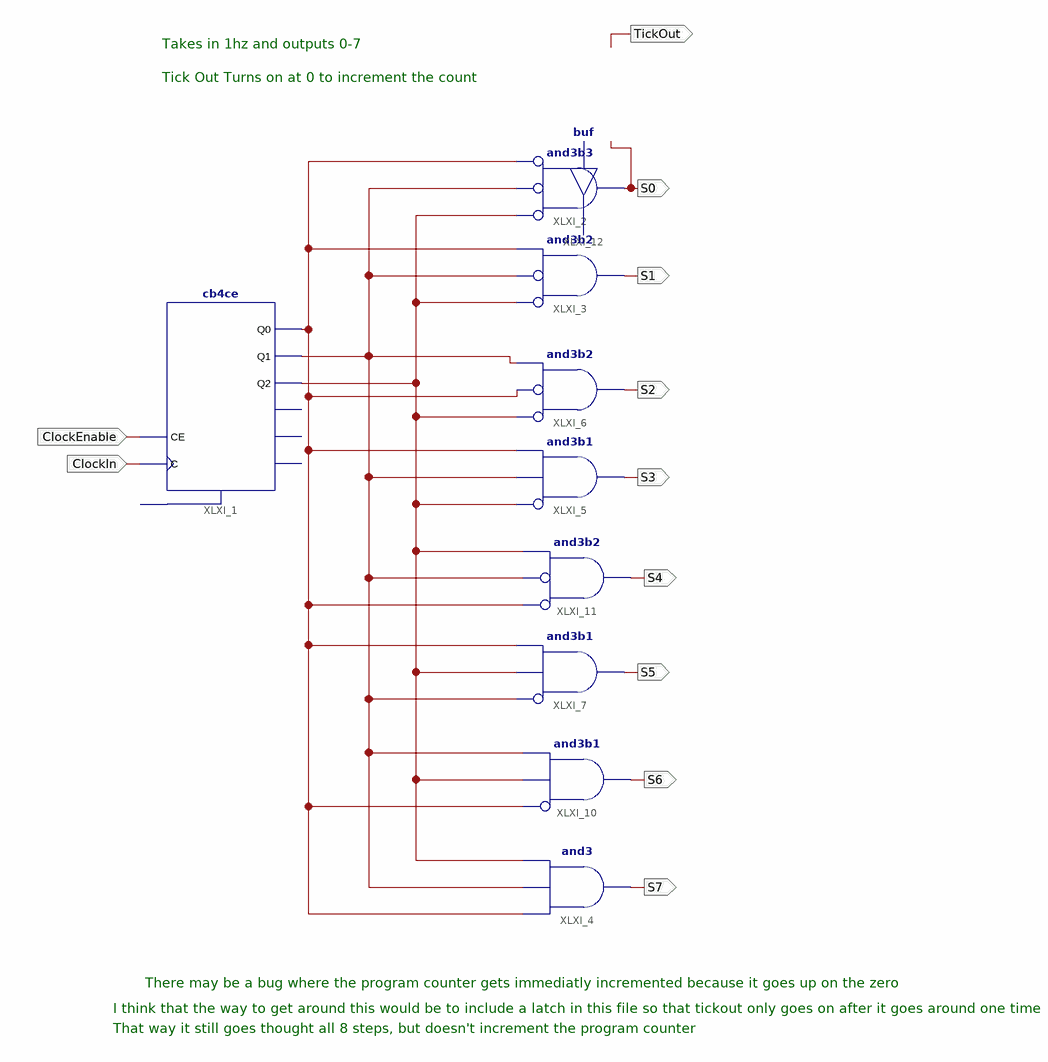
[diagram p0: schematic sheet 1]
// Xilinx ISE schematic TickerTocker.sch (spartan3e) as structural Verilog: 10 symbols, 11 ports
module TickerTocker (
  input  ClockEnable,
  input  ClockIn,
  output S0,
  output S1,
  output S2,
  output S3,
  output S4,
  output S5,
  output S6,
  output S7,
  output TickOut
);

  wire XLXN_4, XLXN_6, XLXN_8;

  cb4ce XLXI_1 (.C(ClockIn), .CE(ClockEnable), .Q0(XLXN_4), .Q1(XLXN_8), .Q2(XLXN_6));  // open: CLR, CEO, Q3, TC
  and XLXI_2 (S0, ~XLXN_6, ~XLXN_8, ~XLXN_4);  // and3b3
  and XLXI_3 (S1, ~XLXN_6, ~XLXN_8, XLXN_4);  // and3b2
  and XLXI_11 (S4, ~XLXN_4, ~XLXN_8, XLXN_6);  // and3b2
  and XLXI_5 (S3, ~XLXN_6, XLXN_8, XLXN_4);  // and3b1
  and XLXI_6 (S2, ~XLXN_6, ~XLXN_4, XLXN_8);  // and3b2
  and XLXI_7 (S5, ~XLXN_8, XLXN_6, XLXN_4);  // and3b1
  and XLXI_10 (S6, ~XLXN_4, XLXN_6, XLXN_8);  // and3b1
  and XLXI_4 (S7, XLXN_4, XLXN_8, XLXN_6);
  buf XLXI_12 (TickOut, S0);

  // Notes on the sheet:
  //   Takes in 1hz and outputs 0-7
  //   Tick Out Turns on at 0 to increment the count
  //   There may be a bug where the program counter gets immediatly incremented because it goes up on the zero
  //   I think that the way to get around this would be to include a latch in this file so that tickout only goes on after it goes around one time
  //   That way it still goes thought all 8 steps, but doesn't increment the program counter
endmodule
